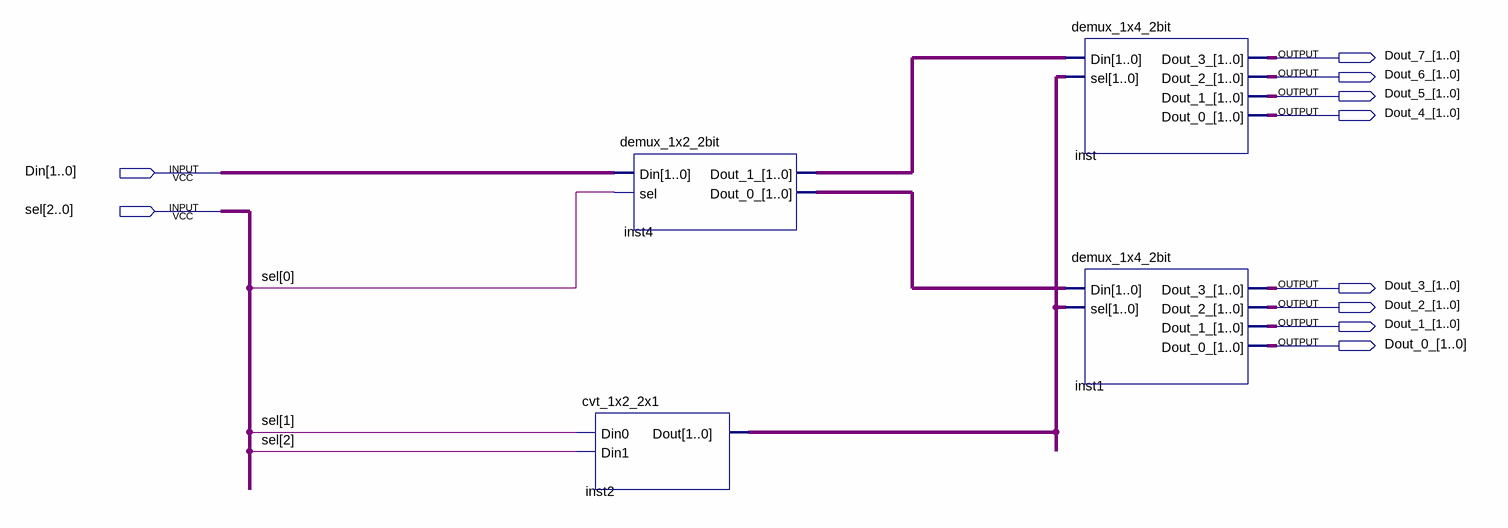
[diagram p0: schematic sheet]
// Quartus schematic demux_1x8_2bit.bdf as structural Verilog: 4 symbols, 10 pins
module demux_1x8_2bit (
  input  [1:0] Din,
  input  [2:0] sel,
  output [1:0] Dout_7_,
  output [1:0] Dout_6_,
  output [1:0] Dout_5_,
  output [1:0] Dout_4_,
  output [1:0] Dout_3_,
  output [1:0] Dout_2_,
  output [1:0] Dout_1_,
  output [1:0] Dout_0_
);

  wire [1:0] inst2_dout, inst4_dout_0_, inst4_dout_1_;

  cvt_1x2_2x1 inst2 (.Din0(sel[1]), .Din1(sel[2]), .Dout(inst2_dout));
  demux_1x2_2bit inst4 (.Din(Din), .sel(sel[0]), .Dout_1_(inst4_dout_1_), .Dout_0_(inst4_dout_0_));
  demux_1x4_2bit inst (
    .Din(inst4_dout_1_), .sel(inst2_dout), .Dout_3_(Dout_7_), .Dout_2_(Dout_6_), .Dout_1_(Dout_5_),
    .Dout_0_(Dout_4_));
  demux_1x4_2bit inst1 (
    .Din(inst4_dout_0_), .sel(inst2_dout), .Dout_3_(Dout_3_), .Dout_2_(Dout_2_), .Dout_1_(Dout_1_),
    .Dout_0_(Dout_0_));
endmodule
